# Altium schematic sheet S7CAS-PLEIADES-CARTE-MERE_Pxx_CAN.SchDoc
size Tabloid; SheetNumber: 12; SheetTotal: 18; Sheet_Name: CAN; Size: 11x17
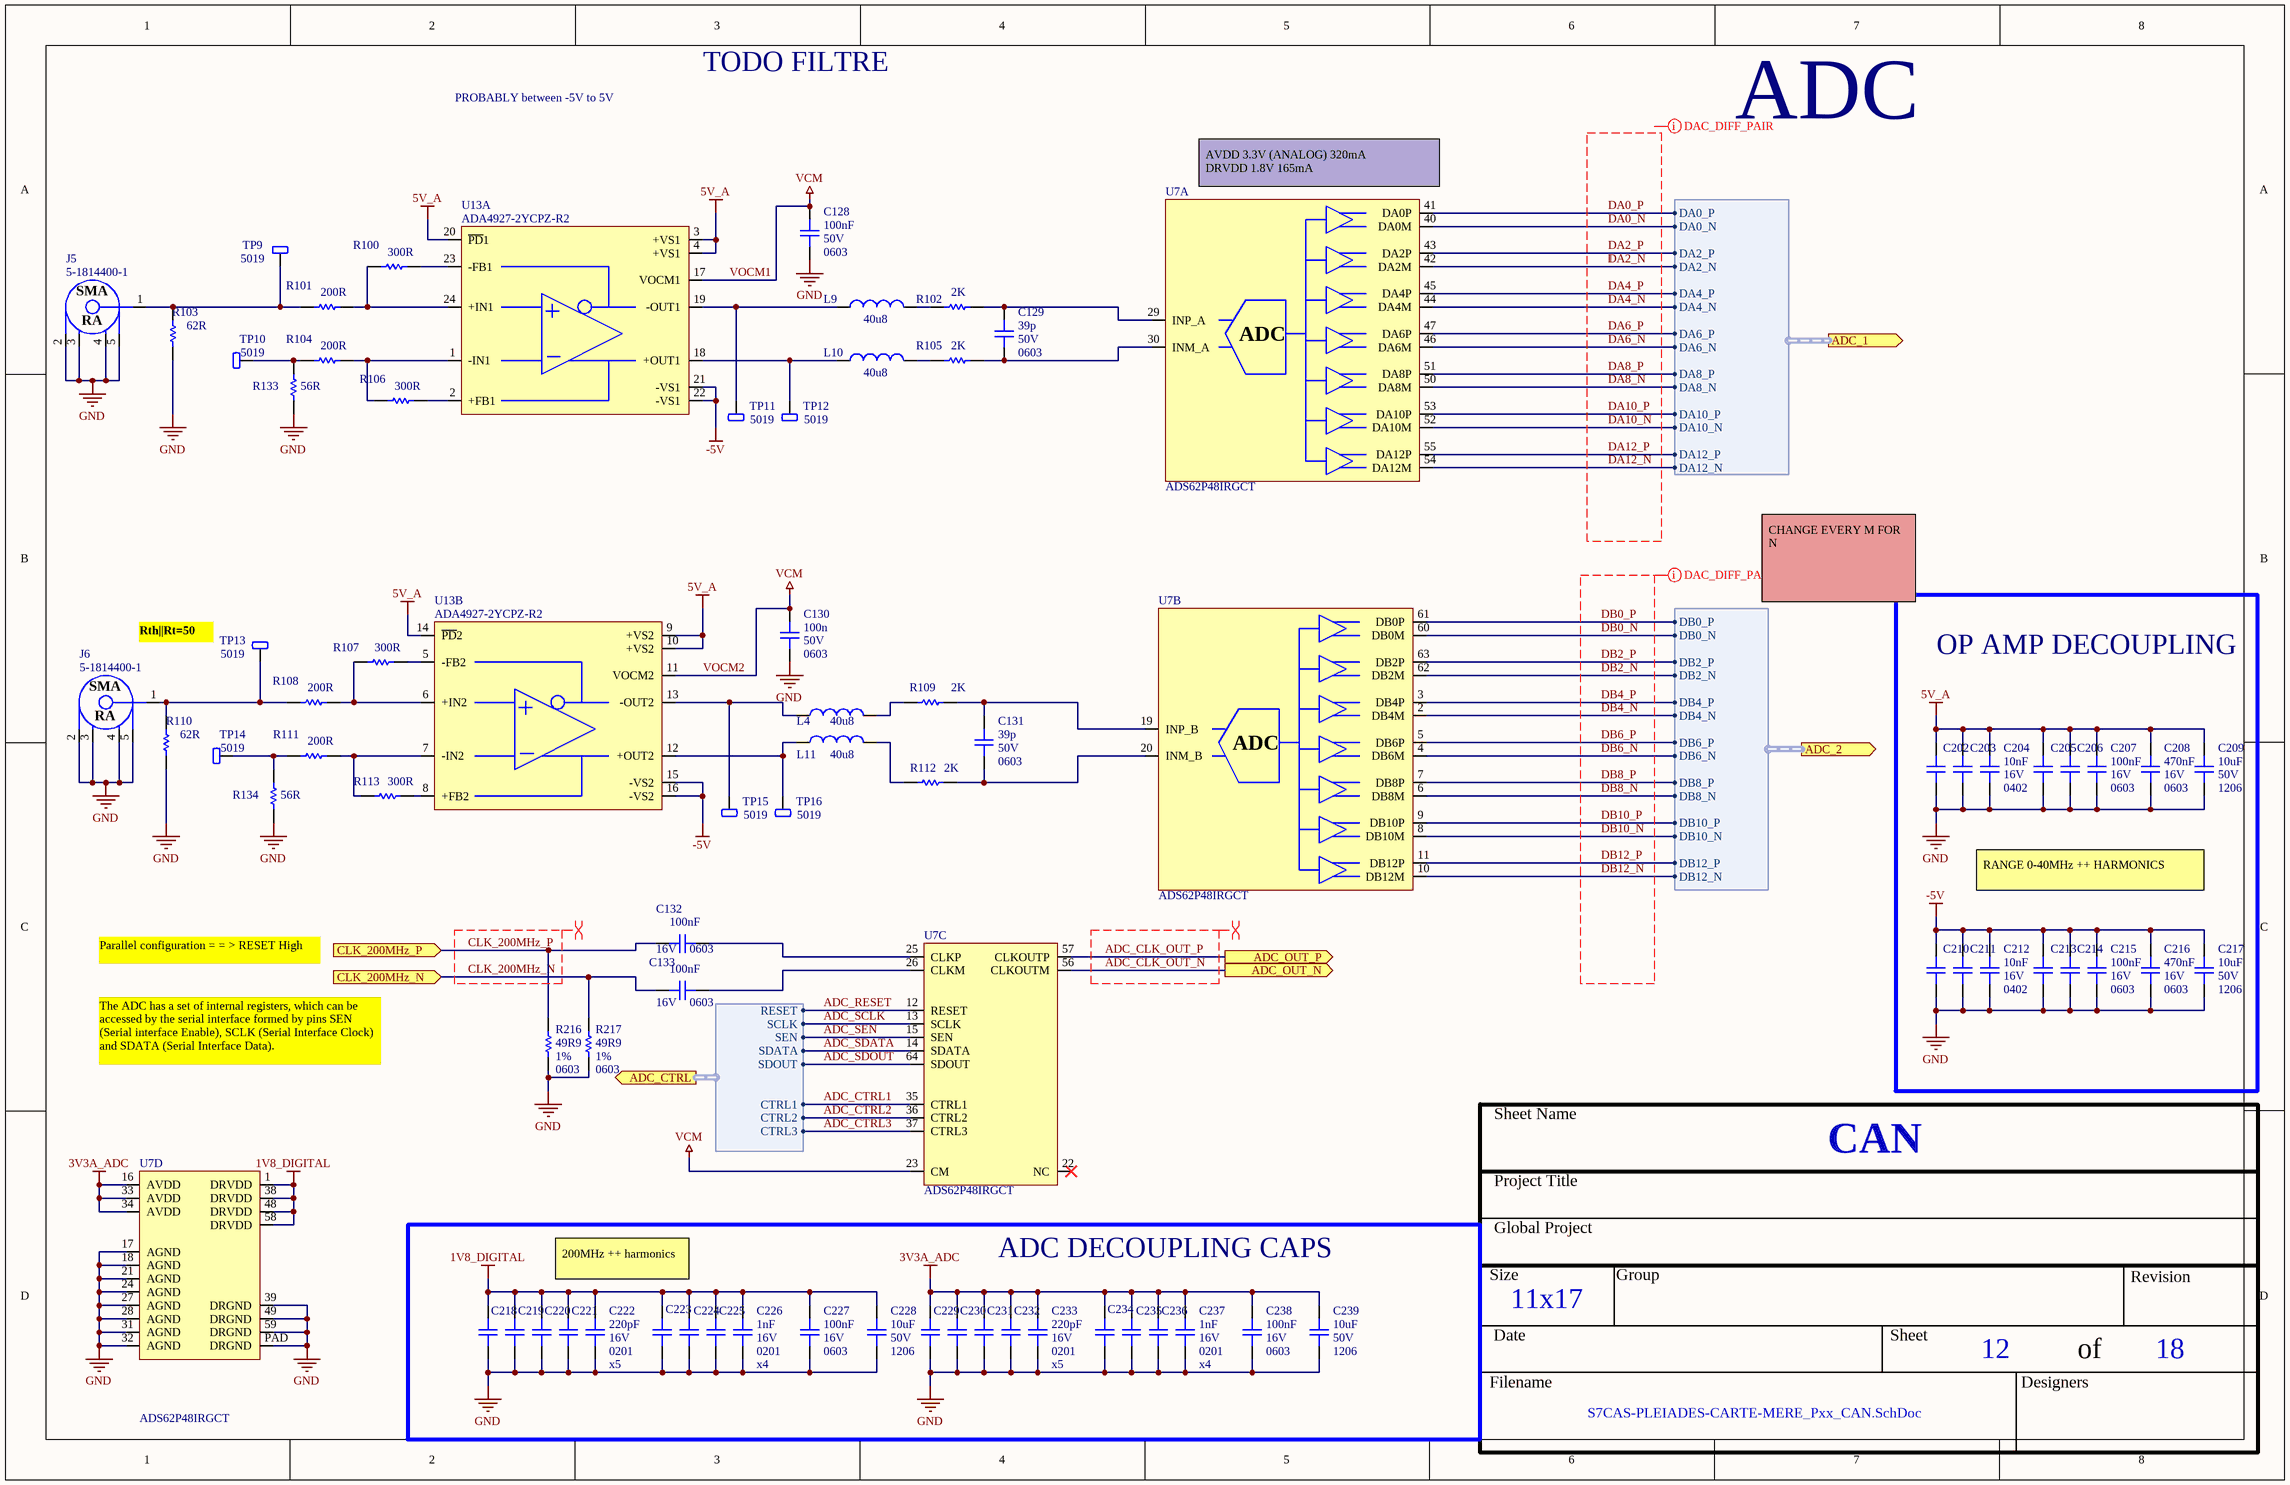
[diagram p0: S7CAS-PLEIADES-CARTE-MERE_Pxx_CAN.SchDoc]

## Parts
C128  value 100nF  Voltage: 50V  Package: 0603  [CAP_0603]  (hidden comment: CAP - 0603)
C129  value 39p  Voltage: 50V  Package: 0603  [CAP_0603]  (hidden comment: CAP - 0603)
C130  value 100n  Voltage: 50V  Package: 0603  [CAP_0603]  (hidden comment: CAP - 0603)
C131  value 39p  Voltage: 50V  Package: 0603  [CAP_0603]  (hidden comment: CAP - 0603)
C132  value 100nF  Voltage: 16V  Package: 0603  [CAP_0603]  (hidden comment: CAP - 0603)
C133  value 100nF  Voltage: 16V  Package: 0603  [CAP_0603]  (hidden comment: CAP - 0603)
C202  CAP - 0402  [CAP_0402]  (value not drawn)
C203  CAP - 0402  [CAP_0402]  (value not drawn)
C204  value 10nF  Voltage: 16V  Package: 0402  [CAP_0402]  (hidden comment: CAP - 0402)
C205  CAP - 0603  [CAP_0603]  (value not drawn)
C206  CAP - 0603  [CAP_0603]  (value not drawn)
C207  value 100nF  Voltage: 16V  Package: 0603  [CAP_0603]  (hidden comment: CAP - 0603)
C208  value 470nF  Voltage: 16V  Package: 0603  [CAP_0603]  (hidden comment: CAP - 0603)
C209  value 10uF  Voltage: 50V  Package: 1206  [CAP_1206]  (hidden comment: CAP - 1206)
C210  CAP - 0402  [CAP_0402]  (value not drawn)
C211  CAP - 0402  [CAP_0402]  (value not drawn)
C212  value 10nF  Voltage: 16V  Package: 0402  [CAP_0402]  (hidden comment: CAP - 0402)
C213  CAP - 0603  [CAP_0603]  (value not drawn)
C214  CAP - 0603  [CAP_0603]  (value not drawn)
C215  value 100nF  Voltage: 16V  Package: 0603  [CAP_0603]  (hidden comment: CAP - 0603)
C216  value 470nF  Voltage: 16V  Package: 0603  [CAP_0603]  (hidden comment: CAP - 0603)
C217  value 10uF  Voltage: 50V  Package: 1206  [CAP_1206]  (hidden comment: CAP - 1206)
C218  CAP - 0201  [CAP_0201]  (value not drawn)
C219  CAP - 0201  [CAP_0201]  (value not drawn)
C220  CAP - 0201  [CAP_0201]  (value not drawn)
C221  CAP - 0201  [CAP_0201]  (value not drawn)
C222  value 220pF  Voltage: 16V  Package: 0201  [CAP_0201]  (hidden comment: CAP - 0201)
C223  CAP - 0201  [CAP_0201]  (value not drawn)
C224  CAP - 0201  [CAP_0201]  (value not drawn)
C225  CAP - 0201  [CAP_0201]  (value not drawn)
C226  value 1nF  Voltage: 16V  Package: 0201  [CAP_0201]  (hidden comment: CAP - 0201)
C227  value 100nF  Voltage: 16V  Package: 0603  [CAP_0603]  (hidden comment: CAP - 0603)
C228  value 10uF  Voltage: 50V  Package: 1206  [CAP_1206]  (hidden comment: CAP - 1206)
C229  CAP - 0201  [CAP_0201]  (value not drawn)
C230  CAP - 0201  [CAP_0201]  (value not drawn)
C231  CAP - 0201  [CAP_0201]  (value not drawn)
C232  CAP - 0201  [CAP_0201]  (value not drawn)
C233  value 220pF  Voltage: 16V  Package: 0201  [CAP_0201]  (hidden comment: CAP - 0201)
C234  CAP - 0201  [CAP_0201]  (value not drawn)
C235  CAP - 0201  [CAP_0201]  (value not drawn)
C236  CAP - 0201  [CAP_0201]  (value not drawn)
C237  value 1nF  Voltage: 16V  Package: 0201  [CAP_0201]  (hidden comment: CAP - 0201)
C238  value 100nF  Voltage: 16V  Package: 0603  [CAP_0603]  (hidden comment: CAP - 0603)
C239  value 10uF  Voltage: 50V  Package: 1206  [CAP_1206]  (hidden comment: CAP - 1206)
J5  5-1814400-1  [CONN_SMA_5-1814400-1]
J6  5-1814400-1  [CONN_SMA_5-1814400-1]
L4  value 40u8  [INDUCT_0603]  (hidden comment: INDUCTOR - 0603)
L9  value 40u8  [INDUCT_0603]  (hidden comment: INDUCTOR - 0603)
L10  value 40u8  [INDUCT_0603]  (hidden comment: INDUCTOR - 0603)
L11  value 40u8  [INDUCT_0603]  (hidden comment: INDUCTOR - 0603)
R100  value 300R  [RES_0603]  (hidden comment: RES - 0603)
R101  value 200R  [RES_0603]  (hidden comment: RES - 0603)
R102  value 2K  [RES_0603]  (hidden comment: RES - 0603)
R103  value 62R  [RES_0603]  (hidden comment: RES - 0603)
R104  value 200R  [RES_0603]  (hidden comment: RES - 0603)
R105  value 2K  [RES_0603]  (hidden comment: RES - 0603)
R106  value 300R  [RES_0603]  (hidden comment: RES - 0603)
R107  value 300R  [RES_0603]  (hidden comment: RES - 0603)
R108  value 200R  [RES_0603]  (hidden comment: RES - 0603)
R109  value 2K  [RES_0603]  (hidden comment: RES - 0603)
R110  value 62R  [RES_0603]  (hidden comment: RES - 0603)
R111  value 200R  [RES_0603]  (hidden comment: RES - 0603)
R112  value 2K  [RES_0603]  (hidden comment: RES - 0603)
R113  value 300R  [RES_0603]  (hidden comment: RES - 0603)
R133  value 56R  [RES_0603]  (hidden comment: RES - 0603)
R134  value 56R  [RES_0603]  (hidden comment: RES - 0603)
R216  value 49R9  Package: 0603  Precision: 1%  [RES_0603]  (hidden comment: RES - 0603)
R217  value 49R9  Package: 0603  Precision: 1%  [RES_0603]  (hidden comment: RES - 0603)
TP9  5019  [TPO_SMD_5019]
TP10  5019  [TPO_SMD_5019]
TP11  5019  [TPO_SMD_5019]
TP12  5019  [TPO_SMD_5019]
TP13  5019  [TPO_SMD_5019]
TP14  5019  [TPO_SMD_5019]
TP15  5019  [TPO_SMD_5019]
TP16  5019  [TPO_SMD_5019]
U7  ADS62P48IRGCT  [ADC_ADS62P48IRGCT]  (parts A,B,C,D of 4)
U13  ADA4927-2YCPZ-R2  [OPAMP_ADA4927-2YCPZ-R2]  (parts A,B of 2)

## Blocks framed on the sheet
OP AMP DECOUPLING: C202-C217
ADC DECOUPLING CAPS: C218-C239

## Ports
ADC_1 (out, harness ADC_1_HARNESS, see S7CAS-PLEIADES-CARTE-MERE_Pxx_FPGA_bank3[1A]), ADC_2 (out, harness ADC_2_HARNESS, see S7CAS-PLEIADES-CARTE-MERE_Pxx_FPGA_bank3[1B]), ADC_CTRL (out, harness ADC_CTRL_HARNESS, see S7CAS-PLEIADES-CARTE-MERE_Pxx_FPGA_bank3[2C]), ADC_OUT_N (out, see S7CAS-PLEIADES-CARTE-MERE_Pxx_FPGA_bank3[4B]), ADC_OUT_P (out, see S7CAS-PLEIADES-CARTE-MERE_Pxx_FPGA_bank3[4B]), CLK_200MHz_N (in, see S7CAS-PLEIADES-CARTE-MERE_Pxx_FLASH_PHY_CLOCK[5A]), CLK_200MHz_P (in, see S7CAS-PLEIADES-CARTE-MERE_Pxx_FLASH_PHY_CLOCK[5A])

## Harnesses
ADC_1_HARNESS: DA0_P, DA0_N, DA2_P, DA2_N, DA4_P, DA4_N, DA6_P, DA6_N, DA8_P, DA8_N, DA10_P, DA10_N, DA12_P, DA12_N
ADC_2_HARNESS: DB0_P, DB0_N, DB2_P, DB2_N, DB4_P, DB4_N, DB6_P, DB6_N, DB8_P, DB8_N, DB10_P, DB10_N, DB12_P, DB12_N
ADC_CTRL_HARNESS: RESET, SCLK, SEN, SDATA, SDOUT, CTRL1, CTRL2, CTRL3

## Nets
1V8_DIGITAL: C218.2 C219.2 C220.2 C221.2 C222.2 C223.2 C224.2 C225.2 C226.2 C227.2 C228.2 U7.1(DRVDD) U7.38(DRVDD) U7.48(DRVDD) U7.58(DRVDD)
3V3A_ADC: C229.2 C230.2 C231.2 C232.2 C233.2 C234.2 C235.2 C236.2 C237.2 C238.2 C239.2 U7.16(AVDD) U7.33(AVDD) U7.34(AVDD)
5V_A: C202.2 C203.2 C204.2 C205.2 C206.2 C207.2 C208.2 C209.2 U13.3(+VS1) U13.4(+VS1) U13.9(+VS2) U13.10(+VS2) U13.14(~{PD}2) U13.20(~{PD}1)
-5V: C210.2 C211.2 C212.2 C213.2 C214.2 C215.2 C216.2 C217.2 U13.15(-VS2) U13.16(-VS2) U13.21(-VS1) U13.22(-VS1)
GND: C128.1 C130.1 C202.1 C203.1 C204.1 C205.1 C206.1 C207.1 C208.1 C209.1 C210.1 C211.1 C212.1 C213.1 C214.1 C215.1 C216.1 C217.1 C218.1 C219.1 C220.1 C221.1 C222.1 C223.1 C224.1 C225.1 C226.1 C227.1 C228.1 C229.1 C230.1 C231.1 C232.1 C233.1 C234.1 C235.1 C236.1 C237.1 C238.1 C239.1 J5.2 J5.3 J5.4 J5.5 J6.2 J6.3 J6.4 J6.5 R103.1 R110.1 R133.2 R134.2 R216.1 R217.1 U7.17(AGND) U7.18(AGND) U7.21(AGND) U7.24(AGND) U7.27(AGND) U7.28(AGND) U7.31(AGND) U7.32(AGND) U7.39(DRGND) U7.49(DRGND) U7.59(DRGND) U7.PAD(DRGND)
VOCM1: C128.2 C130.2 U7.23(CM) U13.11(VOCM2) U13.17(VOCM1)  [also labelled VCM, VOCM2]
: U7.42(DA2M) ; port ADC_1.DA2_N  [also labelled DA2_N]
ADC_CLK_OUT_N: U7.56(CLKOUTM) ; port ADC_OUT_N
ADC_CLK_OUT_P: U7.57(CLKOUTP) ; port ADC_OUT_P
ADC_CTRL1: U7.35(CTRL1) ; port ADC_CTRL.CTRL1
ADC_CTRL2: U7.36(CTRL2) ; port ADC_CTRL.CTRL2
ADC_CTRL3: U7.37(CTRL3) ; port ADC_CTRL.CTRL3
ADC_RESET: U7.12(RESET) ; port ADC_CTRL.RESET
ADC_SCLK: U7.13(SCLK) ; port ADC_CTRL.SCLK
ADC_SDATA: U7.14(SDATA) ; port ADC_CTRL.SDATA
ADC_SDOUT: U7.64(SDOUT) ; port ADC_CTRL.SDOUT
ADC_SEN: U7.15(SEN) ; port ADC_CTRL.SEN
CLK_200MHz_N: C133.2 R217.2 ; port CLK_200MHz_N
CLK_200MHz_P: C132.2 R216.2 ; port CLK_200MHz_P
DA0_N: U7.40(DA0M) ; port ADC_1.DA0_N
DA0_P: U7.41(DA0P) ; port ADC_1.DA0_P
DA2_P: U7.43(DA2P) ; port ADC_1.DA2_P
DA4_N: U7.44(DA4M) ; port ADC_1.DA4_N
DA4_P: U7.45(DA4P) ; port ADC_1.DA4_P
DA6_N: U7.46(DA6M) ; port ADC_1.DA6_N
DA6_P: U7.47(DA6P) ; port ADC_1.DA6_P
DA8_N: U7.50(DA8M) ; port ADC_1.DA8_N
DA8_P: U7.51(DA8P) ; port ADC_1.DA8_P
DA10_N: U7.52(DA10M) ; port ADC_1.DA10_N
DA10_P: U7.53(DA10P) ; port ADC_1.DA10_P
DA12_N: U7.54(DA12M) ; port ADC_1.DA12_N
DA12_P: U7.55(DA12P) ; port ADC_1.DA12_P
DB0_N: U7.60(DB0M) ; port ADC_2.DB0_N
DB0_P: U7.61(DB0P) ; port ADC_2.DB0_P
DB2_N: U7.62(DB2M) ; port ADC_2.DB2_N
DB2_P: U7.63(DB2P) ; port ADC_2.DB2_P
DB4_N: U7.2(DB4M) ; port ADC_2.DB4_N
DB4_P: U7.3(DB4P) ; port ADC_2.DB4_P
DB6_N: U7.4(DB6M) ; port ADC_2.DB6_N
DB6_P: U7.5(DB6P) ; port ADC_2.DB6_P
DB8_N: U7.6(DB8M) ; port ADC_2.DB8_N
DB8_P: U7.7(DB8P) ; port ADC_2.DB8_P
DB10_N: U7.8(DB10M) ; port ADC_2.DB10_N
DB10_P: U7.9(DB10P) ; port ADC_2.DB10_P
DB12_N: U7.10(DB12M) ; port ADC_2.DB12_N
DB12_P: U7.11(DB12P) ; port ADC_2.DB12_P
NetC129_1: C129.1 R105.1 U7.30(INM_A)
NetC129_2: C129.2 R102.1 U7.29(INP_A)
NetC131_1: C131.1 R112.1 U7.20(INM_B)
NetC131_2: C131.2 R109.1 U7.19(INP_B)
NetC132_1: C132.1 U7.25(CLKP)
NetC133_1: C133.1 U7.26(CLKM)
NetJ5_1: J5.1 R101.2 R103.2 TP9.1
NetJ6_1: J6.1 R108.2 R110.2 TP13.1
NetL4_1: L4.1 TP15.1 U13.13(-OUT2)
NetL4_2: L4.2 R109.2
NetL9_1: L9.1 TP11.1 U13.19(-OUT1)
NetL9_2: L9.2 R102.2
NetL10_1: L10.1 TP12.1 U13.18(+OUT1)
NetL10_2: L10.2 R105.2
NetL11_1: L11.1 TP16.1 U13.12(+OUT2)
NetL11_2: L11.2 R112.2
NetR100_1: R100.1 U13.23(-FB1)
NetR100_2: R100.2 R101.1 U13.24(+IN1)
NetR104_1: R104.1 R106.2 U13.1(-IN1)
NetR104_2: R104.2 R133.1 TP10.1
NetR106_1: R106.1 U13.2(+FB1)
NetR107_1: R107.1 U13.5(-FB2)
NetR107_2: R107.2 R108.1 U13.6(+IN2)
NetR111_1: R111.1 R113.2 U13.7(-IN2)
NetR111_2: R111.2 R134.1 TP14.1
NetR113_1: R113.1 U13.8(+FB2)

Not connected (* = marked no-connect by the designer): U7 22(NC)*

## Layout directives
differential pair: (no net found under the mark), ADC_CLK_OUT_N, ADC_CLK_OUT_P, CLK_200MHz_N, CLK_200MHz_P, DB0_N, DB0_P, DB2_N, DB2_P, DB4_N, DB4_P, DB6_N, DB6_P, DB8_N, DB8_P, DB10_N, DB10_P, DB12_N, DB12_P

## Notes on the sheet
- TODO FILTRE
- PROBABLY between -5V to 5V
- ADC
- (near U7) AVDD 3.3V (ANALOG) 320mA
  DRVDD 1.8V 165mA
- CHANGE EVERY M FOR N
- Rth||Rt=50
- RANGE 0-40MHz ++ HARMONICS
- Parallel configuration = = > RESET High
- The ADC has a set of internal registers, which can be accessed by the serial interface formed by pins SEN
  (Serial interface Enable), SCLK (Serial Interface Clock) and SDATA (Serial Interface Data).
- 200MHz ++ harmonics
- (near C222) x5
- (near C226) x4
- (near C233) x5
- (near C237) x4
- Sheet Name
- Project Title
- Global Project
- Size
- Group
- Revision
- Date
- Sheet
- of
- Filename
- Designers
- (in symbol ADC_ADS62P48IRGCT, part A) ADC
- (in symbol ADC_ADS62P48IRGCT, part B) ADC
- (in symbol CONN_SMA_5-1814400-1) SMA; RA

## Library data of the parts
C128-C133 C207 C208 C215 C216 C227 C238 = CAP - 0603: Precision: 10%; Current: *; CreatedBy: Jonathan Bouchard; Power: *
  C132 C133 C207 C215 C227 C238: Supplier 1: Arrow Electronics; Supplier Part Number 1: CL10B104KO8NNNC
  C208 C216: Supplier 1: Arrow Electronics; Supplier Part Number 1: C1608X7R1C474K080AC
C202 C203 C210 C211 = CAP - 0402: Precision: 10%; Voltage: 16V; Value: 10nF; Current: *; CreatedBy: Jonathan Bouchard; Power: *; Package: 0402; Supplier 1: Arrow Electronics; Supplier Part Number 1: GRM155R61A224KE19D
C204 C212 = CAP - 0402: Precision: 10%; Current: *; CreatedBy: Jonathan Bouchard; Power: *; Supplier 1: Arrow Electronics; Supplier Part Number 1: GRM155R61A224KE19D
C205 C206 C213 C214 = CAP - 0603: Precision: 10%; Voltage: 16V; Value: 100nF; Current: *; CreatedBy: Jonathan Bouchard; Power: *; Package: 0603; Supplier 1: Arrow Electronics; Supplier Part Number 1: CL10B104KO8NNNC
C209 C217 C228 C239 = CAP - 1206: Precision: 10%; Current: *; CreatedBy: Jonathan Bouchard; Power: *; Supplier 1: Avnet; Supplier Part Number 1: CL31A106MBHNNNE
C218-C221 C229-C232 = CAP - 0201: Precision: 10%; Voltage: 16V; Value: 220pF; Current: *; CreatedBy: Jonathan Bouchard; Power: *; Package: 0201; Supplier 1: Arrow Electronics; Supplier Part Number 1: GRM033R71C221KA01D
C222 C226 C233 C237 = CAP - 0201: Precision: 10%; Current: *; CreatedBy: Jonathan Bouchard; Power: *
  C222 C233: Supplier 1: Arrow Electronics; Supplier Part Number 1: GRM033R71C221KA01D
  C226 C237: Supplier 1: Avnet; Supplier Part Number 1: GRM033R71C102KA01J
C223-C225 C234-C236 = CAP - 0201: Precision: 10%; Voltage: 16V; Value: 1nF; Current: *; CreatedBy: Jonathan Bouchard; Power: *; Package: 0201; Supplier 1: Avnet; Supplier Part Number 1: GRM033R71C102KA01J
J5 J6 = CONN_SMA_5-1814400-1: CONN -  SMA JACK R/A 50 OHM - TH; Mfg: TE Connectivity AMP Connectors; Voltage: *; Current: *; Power: *; Mfg Part Number: 5-1814400-1; HelpURL: http://www.te.com/commerce/DocumentDelivery/DDEController?Action=srchrtrv&DocNm=1814400&DocType=Customer+Drawing&DocLang=English; CreatedBy: Jonathan Bouchard; Temperature: -55°C ~ 85°C; Value: *; Precision: *; Package: TH-5; Supplier 1: Digikey; Supplier Part Number 1: A97593-ND
L4 L9-L11 = INDUCT - 0603: GRAMS Lib Spec: 2.7; Saturation Val: *
TP9-TP16 = TPO_SMD_5019: TPO - PC TEST POINT MINI - SMD; Manufacturer #1: Keystone Electronics; Value: 3.81mm x 2.03mm; Polarized: No; Magnetic Material: UNKNOWN; GRAMS Lib Spec: 2.8; Current Rating: *; Manufacturer #2: *; Note: *; Power Max: *; Part Number #2: *; HelpURL: https://www.digikey.ca/product-detail/en/keystone-electronics/5019/36-5019CT-ND/3907344; Supplier 1: Digi-Key; Supplier Part Number 1: 36-5019CT-ND; Assembly Type: SMD; Part Number #1: 5019; Package: SMD; CreatedBy/Date: Olivier Bernard / 5/12/2017; Temperature: *; Tolerance: *; VerifiedBy: Caroline Paulin / 5 juillet 2018; Voltage Rating: *; Cryo: UNKNOWN
U7 = ADC_ADS62P48IRGCT: ADC - 14 BIT 210MSPS SUAL - VQFN-64; Voltage: 3.15 V ~ 3.6 V / 1.7 V ~ 1.9 V; Mfg: Texas Instruments; Precision: 14 Bit; Current: *; Power: *; Mfg Part Number: ADS62P48IRGCT; HelpURL: http://www.ti.com/lit/ds/symlink/ads62p48.pdf; CreatedBy: Jonathan Bouchard; Temperature: -40°C ~ 85°C; Value: *; Package: VQFN-64; Supplier 1: Digikey; Supplier Part Number 1: 296-24611-1-ND
U13 = OPAMP_ADA4927-2YCPZ-R2: OPAMP - CFA 2.3GHZ - QFN-24; Voltage: 4.5 V ~ 11 V, ±2.25 V ~ 5.5 V; Current: 65mA; Mfg: Analog Devices; Power: *; Mfg Part Number: ADA4927-2YCPZ-R2; HelpURL: http://www.analog.com/media/en/technical-documentation/data-sheets/ADA4927-1_4927-2.pdf; CreatedBy: Jonathan Bouchard; Temperature: -40°C ~ 105°C; Value: *; Precision: *; Package: QFN-24; Supplier 1: Digikey; Supplier Part Number 1: ADA4927-2YCPZ-R2CT-ND
R100-R113 R133 R134 R216 R217 = RES - 0603: Current: *; CreatedBy: Jonathan Bouchard
  R216 R217: Supplier 1: Mouser; Supplier Part Number 1: 667-ERJ-3EKF49R9V